# Altium schematic sheet 3_sensors.SchDoc: Sensors/Heating/FMU conn
size A3; SheetNumber: 3; SheetTotal: 3
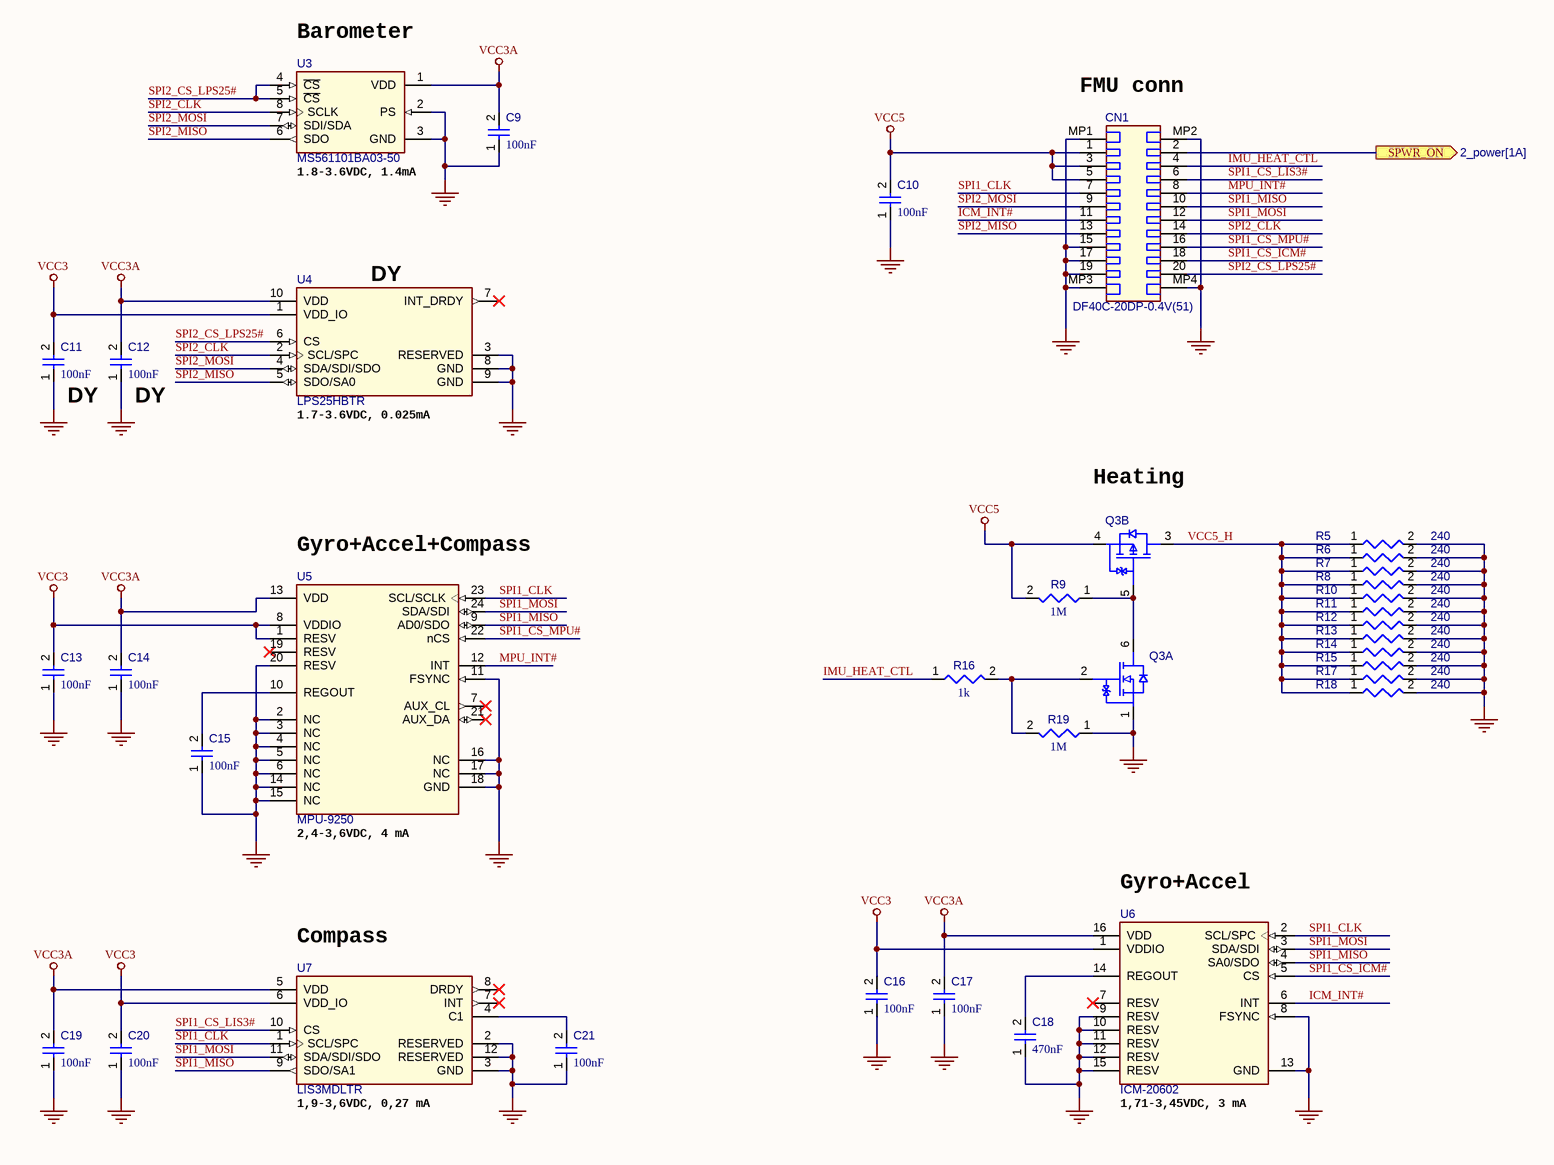
[diagram p0: 3_sensors.SchDoc]

## Parts
C9  value 100nF  [CAPC0402(1005)60_L]  (hidden comment: Capacitor 100nF +/-20% 10V 0402)
C10  value 100nF  [CAPC0402(1005)60_L]  (hidden comment: Capacitor 100nF +/-20% 10V 0402)
C11  value 100nF  [CAPC0402(1005)60_L]  (hidden comment: Capacitor 100nF +/-20% 10V 0402)
C12  value 100nF  [CAPC0402(1005)60_L]  (hidden comment: Capacitor 100nF +/-20% 10V 0402)
C13  value 100nF  [CAPC0402(1005)60_L]  (hidden comment: Capacitor 100nF +/-20% 10V 0402)
C14  value 100nF  [CAPC0402(1005)60_L]  (hidden comment: Capacitor 100nF +/-20% 10V 0402)
C15  value 100nF  [CAPC0402(1005)60_L]  (hidden comment: Capacitor 100nF +/-20% 10V 0402)
C16  value 100nF  [CAPC0402(1005)60_L]  (hidden comment: Capacitor 100nF +/-20% 10V 0402)
C17  value 100nF  [CAPC0402(1005)60_L]  (hidden comment: Capacitor 100nF +/-20% 10V 0402)
C18  value 470nF  [CAPC0402(1005)60_L]  (hidden comment: Capacitor 470nF +/-40% 10V 0402)
C19  value 100nF  [CAPC0402(1005)60_L]  (hidden comment: Capacitor 100nF +/-20% 10V 0402)
C20  value 100nF  [CAPC0402(1005)60_L]  (hidden comment: Capacitor 100nF +/-20% 10V 0402)
C21  value 100nF  [CAPC0402(1005)60_L]  (hidden comment: Capacitor 100nF +/-20% 10V 0402)
CN1  DF40C-20DP-0.4V(51)  [HIRO-DF40C-20DP-0.4V(51)_V]
Q3  DMC1030UFDBQ-7  [DMC1030UFDBQ-7-Footprint-1]  (value not drawn)  (parts A,B of 2)
R5  value 240  [RESC0402(1005)_L]  (hidden comment: Resistor 240R +/-5 % 0402 63 mW)
R6  value 240  [RESC0402(1005)_L]  (hidden comment: Resistor 240R +/-5 % 0402 63 mW)
R7  value 240  [RESC0402(1005)_L]  (hidden comment: Resistor 240R +/-5 % 0402 63 mW)
R8  value 240  [RESC0402(1005)_L]  (hidden comment: Resistor 240R +/-5 % 0402 63 mW)
R9  value 1M  [RESC0402(1005)_L]  (hidden comment: Resistor 1M +/-5 % 0402 63 mW)
R10  value 240  [RESC0402(1005)_L]  (hidden comment: Resistor 240R +/-5 % 0402 63 mW)
R11  value 240  [RESC0402(1005)_L]  (hidden comment: Resistor 240R +/-5 % 0402 63 mW)
R12  value 240  [RESC0402(1005)_L]  (hidden comment: Resistor 240R +/-5 % 0402 63 mW)
R13  value 240  [RESC0402(1005)_L]  (hidden comment: Resistor 240R +/-5 % 0402 63 mW)
R14  value 240  [RESC0402(1005)_L]  (hidden comment: Resistor 240R +/-5 % 0402 63 mW)
R15  value 240  [RESC0402(1005)_L]  (hidden comment: Resistor 240R +/-5 % 0402 63 mW)
R16  value 1k  [RESC0402(1005)_L]  (hidden comment: Resistor 1K +/-5 % 0402 63 mW)
R17  value 240  [RESC0402(1005)_L]  (hidden comment: Resistor 240R +/-5 % 0402 63 mW)
R18  value 240  [RESC0402(1005)_L]  (hidden comment: Resistor 240R +/-5 % 0402 63 mW)
R19  value 1M  [RESC0402(1005)_L]  (hidden comment: Resistor 1M +/-5 % 0402 63 mW)
U3  MS561101BA03-50  [TECO-MS561101BA03_V]
U4  LPS25HBTR  [STM-LGA-10]
U5  MPU-9250  [INSE-QFN-24-1700X1540TP_N]
U6  ICM-20602  [INSE-I62-16]
U7  LIS3MDLTR  [STM-LGA-12]

## Ports
SPWR_ON (out, see 2_power[1A])

## Nets
GND: C9.1 C10.1 C11.1 C12.1 C13.1 C14.1 C15.1 C16.1 C17.1 C18.1 C19.1 C20.1 C21.1 CN1.15 CN1.17 CN1.19 CN1.MP1(MP) CN1.MP2(MP) CN1.MP3(MP) CN1.MP4(MP) Q3.1(S1) R5.2 R6.2 R7.2 R8.2 R10.2 R11.2 R12.2 R13.2 R14.2 R15.2 R17.2 R18.2 R19.1 U3.2(PS) U3.3(GND) U4.3(RESERVED) U4.8(GND) U4.9(GND) U5.2(NC) U5.3(NC) U5.4(NC) U5.5(NC) U5.6(NC) U5.11(FSYNC) U5.14(NC) U5.15(NC) U5.16(NC) U5.17(NC) U5.18(GND) U5.20(RESV) U6.8(FSYNC) U6.9(RESV) U6.10(RESV) U6.11(RESV) U6.12(RESV) U6.13(GND) U6.15(RESV) U7.2(RESERVED) U7.3(GND) U7.12(RESERVED)
VCC3: C11.2 C13.2 C16.2 C20.2 U4.1(VDD_IO) U5.1(RESV) U5.8(VDDIO) U6.1(VDDIO) U7.6(VDD_IO)
VCC3A: C9.2 C12.2 C14.2 C17.2 C19.2 U3.1(VDD) U4.10(VDD) U5.13(VDD) U6.16(VDD) U7.5(VDD)
VCC5: C10.2 CN1.1 CN1.3 CN1.5 Q3.4(S2) R9.2
ICM_INT#: CN1.11 U6.6(INT)
IMU_HEAT_CTL: CN1.4 R16.1
MPU_INT#: CN1.8 U5.12(INT)
SPI1_CLK: CN1.7 U5.23(SCL/SCLK) U6.2(SCL/SPC) U7.1(SCL/SPC)
SPI1_CS_ICM#: CN1.18 U6.5(CS)
SPI1_CS_LIS3#: CN1.6 U7.10(CS)
SPI1_CS_MPU#: CN1.16 U5.22(nCS)
SPI1_MISO: CN1.10 U5.9(AD0/SDO) U6.4(SA0/SDO) U7.9(SDO/SA1)
SPI1_MOSI: CN1.12 U5.24(SDA/SDI) U6.3(SDA/SDI) U7.11(SDA/SDI/SDO)
SPI2_CLK: CN1.14 U3.8(SCLK) U4.2(SCL/SPC)
SPI2_CS_LPS25#: CN1.20 U3.4(~{CS}) U3.5(~{CS}) U4.6(CS)
SPI2_MISO: CN1.13 U3.6(SDO) U4.5(SDO/SA0)
SPI2_MOSI: CN1.9 U3.7(SDI/SDA) U4.4(SDA/SDI/SDO)
SPWR_ON: CN1.2 ; port SPWR_ON
VCC5_H: Q3.3(D2) R5.1 R6.1 R7.1 R8.1 R10.1 R11.1 R12.1 R13.1 R14.1 R15.1 R17.1 R18.1
NetC15_2: C15.2 U5.10(REGOUT)
NetC18_2: C18.2 U6.14(REGOUT)
NetC21_2: C21.2 U7.4(C1)
NetQ3_2: Q3.2(G1) R16.2 R19.2
NetQ3_5: Q3.5(G2) Q3.6(D1) R9.1

Not connected (* = marked no-connect by the designer): U4 7(INT_DRDY)*; U5 7(AUX_CL)* 19(RESV)* 21(AUX_DA)*; U6 7(RESV)*; U7 7(INT)* 8(DRDY)*

## Notes on the sheet
- (near U3) Barometer
- (near CN1) FMU conn
- (near U3) 1.8-3.6VDC, 1.4mA
- (near U4) DY
- (near C11) DY
- (near C12) DY
- (near U4) 1.7-3.6VDC, 0.025mA
- Heating
- (near U5) Gyro+Accel+Compass
- (near U5) 2,4-3,6VDC, 4 mA
- (near U6) Gyro+Accel
- (near U7) Compass
- (near U7) 1,9-3,6VDC, 0,27 mA
- (near U6) 1,71-3,45VDC, 3 mA
- Title
- Size:
- Date:
- A3
- Number:
- Time:
- Revision:
- Sheet
- of
- File:

## Library data of the parts
C9-C17 C19-C21 = CMP-001-00061-9: Chip Capacitor, 100nF +/-20%, 10V, 0402, Thickness 0.6 mm; Manufacturer 1: KEMET; Manufacturer Lifecycle 1: Volume Production; Manufacturer Part Number 1: C0402C104K8RACTU; Tolerance: 20%; Moeda: USD; Preço: 1: 0.013; Preço: 10: 3.38; Preço:100: 28.6; Preço:1000: 130; Min Operating Temperature: -55°C; Voltage Rating: 10V; Max Operating Temperature: 85°C; Pins: 2; Mounting Technology: SMT; Case/Package: 0402; Imagem: https://sigma.octopart.com/cdn-cgi/image/width=75,fit=contain,quality=85,format=auto/10190940/image/Kemet-C0402C104K8RACTU.jpg; Quantity: 26
C18 = CMP-001-00060-8: Chip Capacitor, 470nF +/-40%, 10V, 0402, Thickness 0.6 mm; Tolerance: 20%; Max Operating Temperature: 85°C; Min Operating Temperature: -55°C; Voltage Rating: 10V; Mounting Technology: SMT; Case/Package: 0805; Pins: 2
CN1 = CMP-002-00057-1: Plug Connector, 30 V, 0.3 A, -35 to 85 degC, RoHS, Tape and Reel; Pins: 24; System: Connector
Q3 = CMP-013-00033-1: MOSFET N/P-CH 12V 5.1A UDFN2020; Pins: 6; Max Operating Temperature: 150°C; Min Operating Temperature: -55°C
R5-R8 R10-R15 R17 R18 = CMP-009-00155-2: Chip Resistor, 240 Ohms, +/-5 %, 63 mW, -55 to 155 degC, 0402; Power: 63mW; Tolerance: 5%; Case/Package: 0402; Max Operating Temperature: 155°C; Min Operating Temperature: -55°C; Pins: 2
R9 R19 = CMP-009-00151-3: Chip Resistor, 1 MOhms, +/-5 %, 63 mW, -55 to 155 degC, 0402; Manufacturer 1: Bourns; Manufacturer Lifecycle 1: Volume Production; Manufacturer Part Number 1: CR0402-JW-105GLF; Power: 63mW; Tolerance: 5%; __ORIG_LIFECYCLESTATEGUID__: 706004B5-C76E-482E-903B-BA0E4FAE086A; Moeda: USD; Preço: 1: 0.006; Preço: 10: 0.24; Preço:100: 1.6; Preço:1000: 8; Case/Package: 0402; Max Operating Temperature: 155°C; Min Operating Temperature: -55°C; Pins: 2; Quantity: 534
R16 = CMP-009-00157-3: Chip Resistor, 1 kOhms, +/-5 %, 63 mW, -55 to 155 degC, 0402; Manufacturer 1: Yageo; Manufacturer Lifecycle 1: Volume Production; Manufacturer Part Number 1: RC0402JR-071KL; Power: 63mW; Tolerance: 5%; __ORIG_LIFECYCLESTATEGUID__: 706004B5-C76E-482E-903B-BA0E4FAE086A; Moeda: USD; Preço: 1: 0.011; Preço: 10: 0.44; Preço:100: 2.4; Preço:1000: 16; Case/Package: 0402; Max Operating Temperature: 155°C; Min Operating Temperature: -55°C; Pins: 2; Quantity: 23
U3 = CMP-010-00021-1: Barometric Pressure Sensor, 1.8 to 3.6 V, -40 to 85 degC, 8-Pin SMD, RoHS, Tape and Reel; Sensor Type: Barometer; Min Supply Voltage: 1.8V; Max Supply Voltage: 3.6V; Min Operating Temperature: -40°C; Max Operating Temperature: 85°C; Pins: 8; Mounting Technology: SMT; Case/Package: LGA-8; RoHS Compliant: Yes
U4 = CMP-010-00020-1: MEMS Pressure Sensor, 1.7 to 3.6 V, -30 to 105 degC, 10-Pin LGA, RoHS, Tray; Max Supply Voltage: 3.6V; Min Supply Voltage: 1.7V; Sensor Type: Barometer; RoHS Compliant: Yes; Max Operating Temperature: 105°C; Mounting Technology: SMT; Case/Package: LGA-10; Min Operating Temperature: -30°C; Pins: 10
U5 = CMP-010-00022-1: 9-axis MotionTracking device, 2.4 to 3,6 V, -40 to 85 degC, 24-Pin QFN, RoHS, Tape and Reel; Max Supply Voltage: 3.6V; Min Supply Voltage: 2.4V; Sensor Type: Accelerometer,Gyroscope,Magnetometer; Max Operating Temperature: 85°C; Min Operating Temperature: -40°C; Case/Package: QFN; Pins: 24; Mounting Technology: SMT
U6 = CMP-010-00023-1: High Performance 6-Axis MEMS MotionTracking(TM) Device, 1.71 to 3.45 V, -40 to 85 degC, 16-Pin LGA, RoHS; Sensor Type: 6 Axis,Accelerometer,Gyroscope,Temperature; Min Supply Voltage: 1.71V; Max Supply Voltage: 3.45V; Max Operating Temperature: 85°C; Mounting Technology: SMT; Min Operating Temperature: -40°C; RoHS Compliant: Yes; Case/Package: LGA-16; Pins: 16
U7 = CMP-010-00019-1: Digital Output Magnetic Sensor, 1.9 to 3.6 V, -40 to 85 degC, 12-Pin LGA, RoHS, Tape and Reel; Sensor Type: Magnetometer; Min Supply Voltage: 1.9V; Max Supply Voltage: 3.6V; Min Operating Temperature: -40°C; Max Operating Temperature: 85°C; Case/Package: LGA-12; Mounting Technology: SMT; Pins: 12; RoHS Compliant: Yes